# EAGLE board Speaker_shield (EAGLE 5.11)
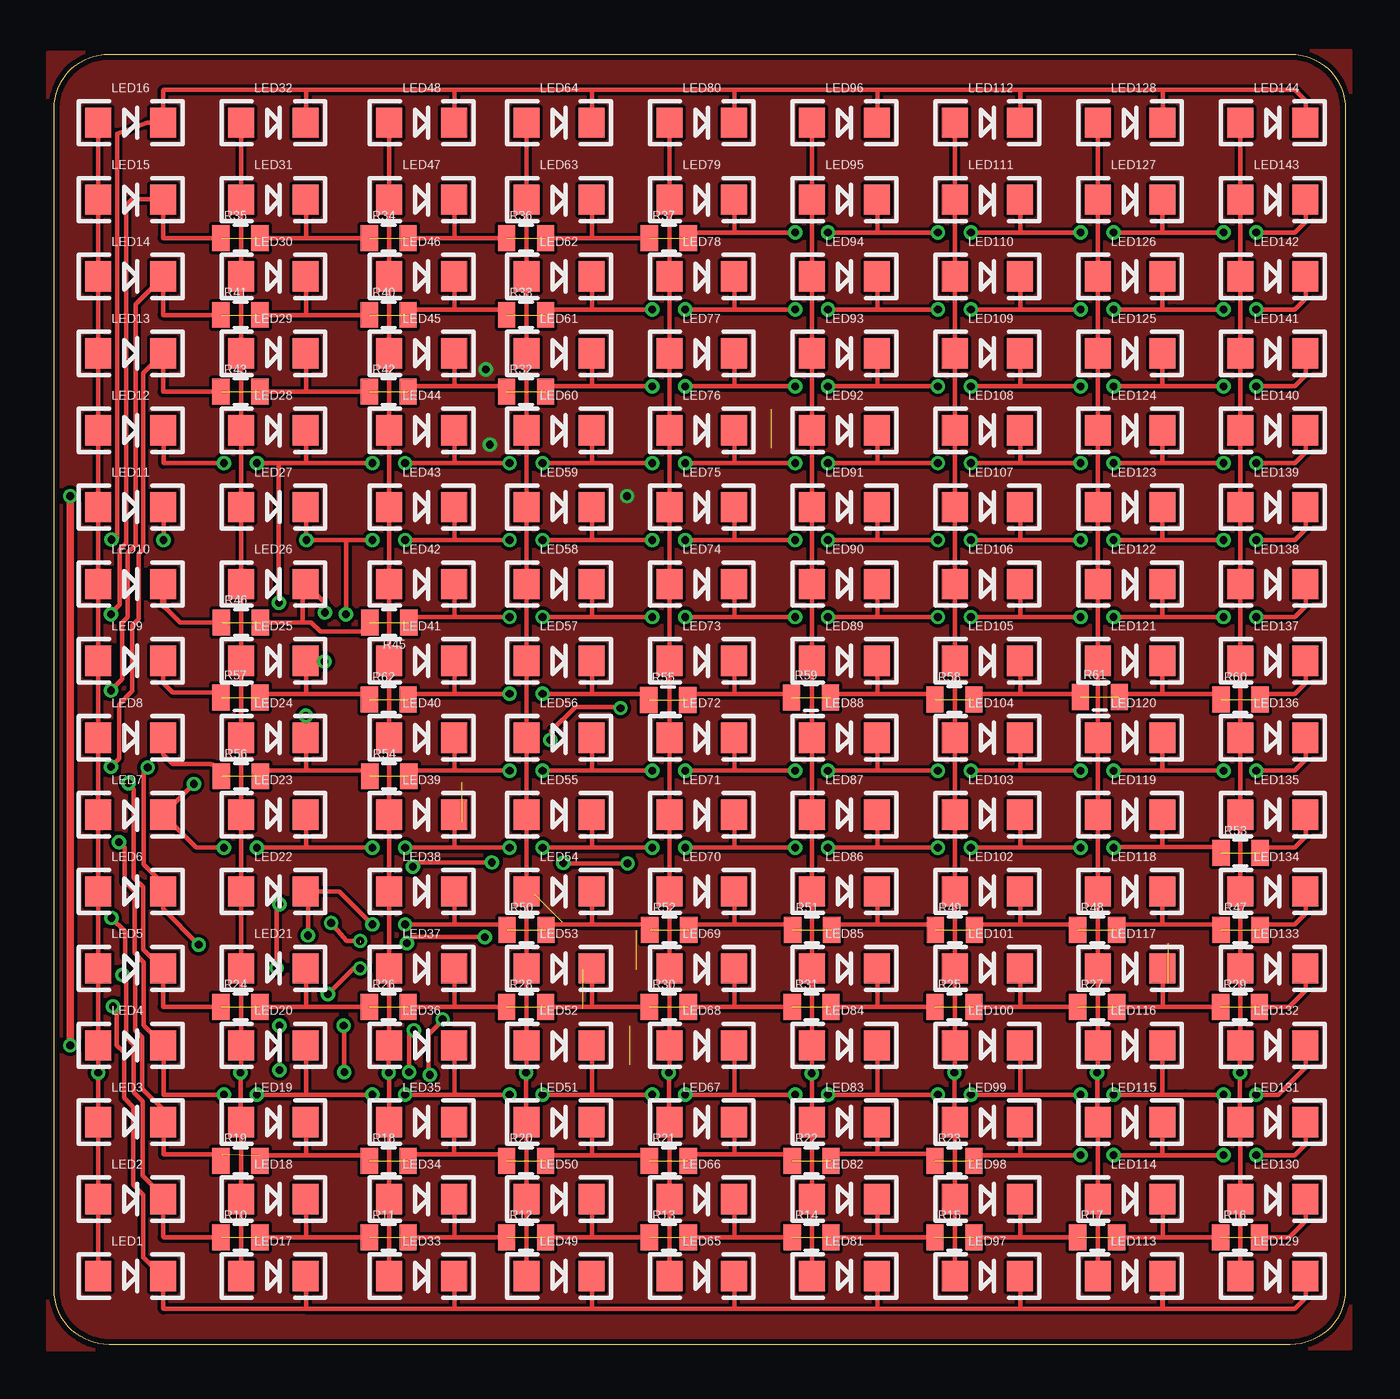
[diagram p3: board, top side]
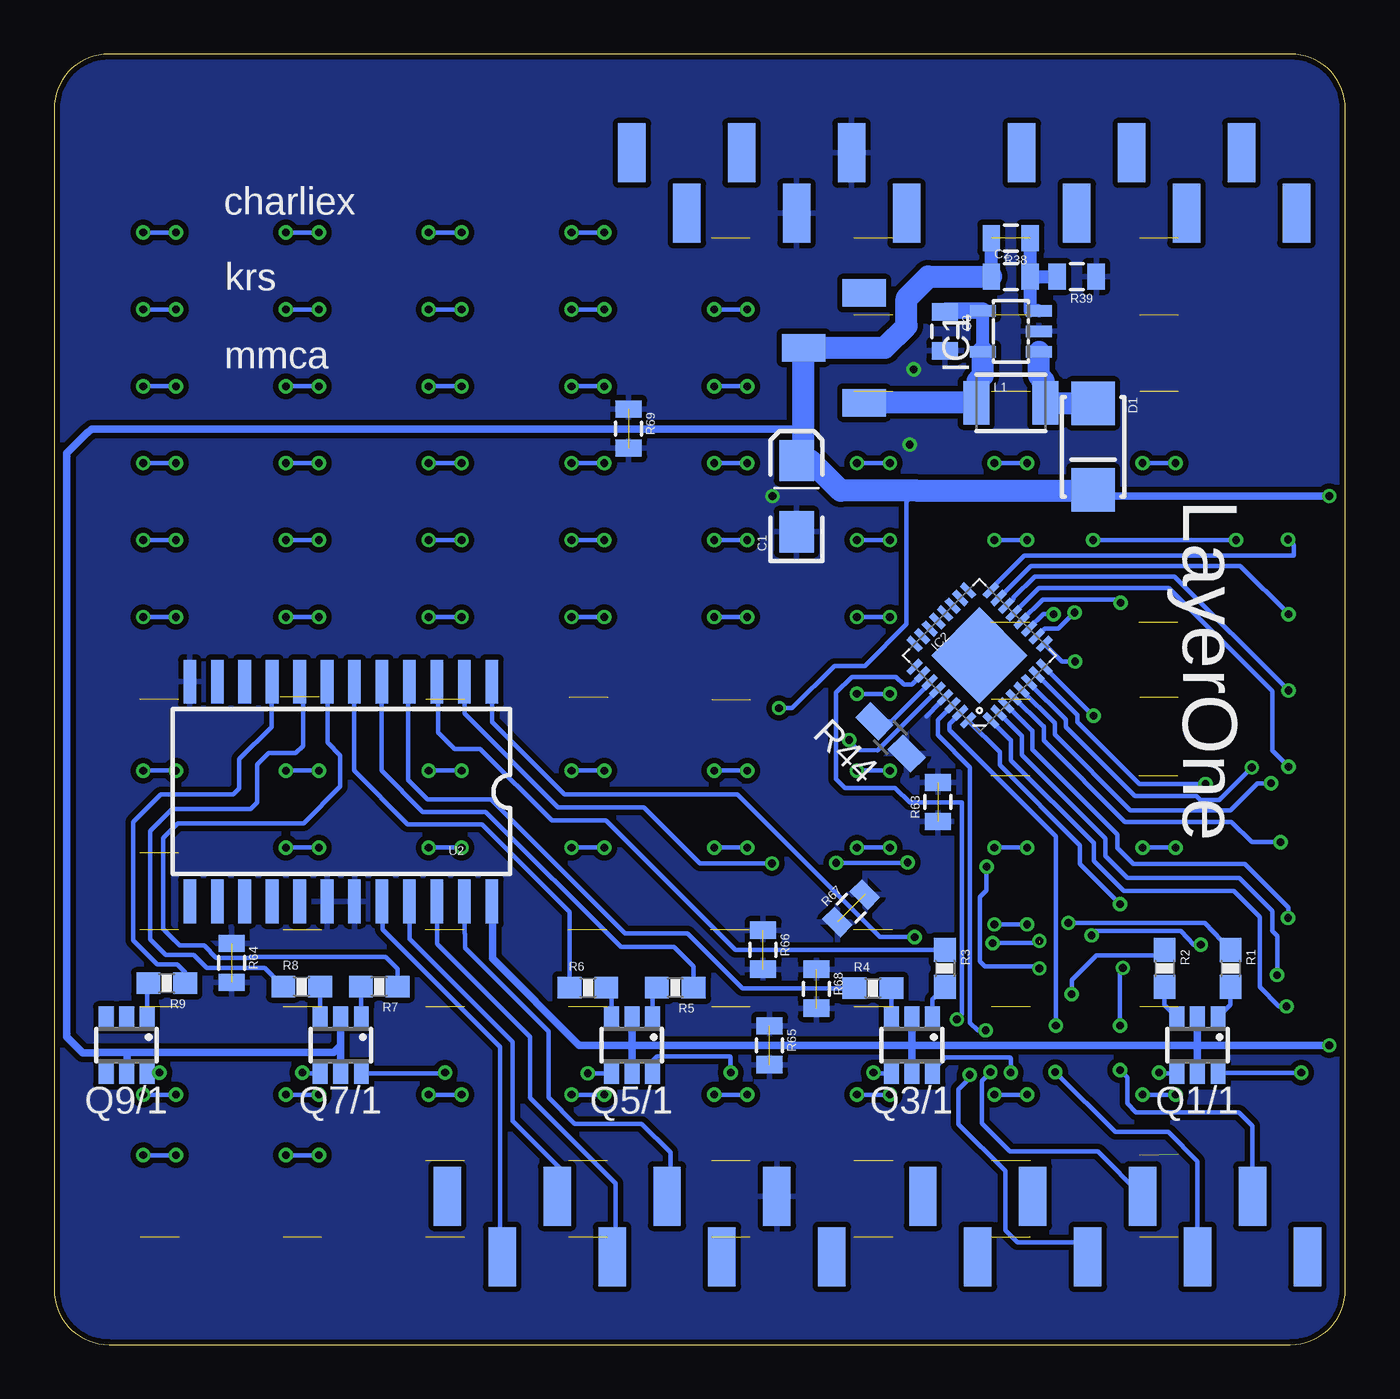
[diagram p4: board, bottom side, seen from below]

Size 59.73 x 59.69 mm. Coordinates in mm from the lower left corner, seen from the top.
Outline: 0,57.15 arc-90 2.54,59.69 57.19,59.69 arc-90 59.73,57.15 59.73,2.54 arc-90 57.19,0 2.54,0 arc-90 0,2.54 0,57.15
Copper layers (1*16): Top 0.035mm / dielectric 1.5mm / Bottom 0.035mm
Design rules "ITead_rule": minimum track width 6mil, minimum drill 12mil, track to track 6mil, track to pad 6mil, pad to pad 6mil, via to via 6mil, smd to smd 0mil, copper to edge 10mil, drill to drill 10mil, minimum pad ring 10mil, minimum via ring 6mil, stop-mask expansion 2mil, vias tented up to drill 100mil, thermal gap 10mil
Net classes: 1 power: width 0.61 mm, drill 0.508 mm, clearance 0.152 mm; 2 gnd: width 0.305 mm, drill 0.508 mm, clearance 0.152 mm; 3 usbvcc: width 0.508 mm, drill 0.508 mm, clearance 0.152 mm; 4 aref: width 0.406 mm

## Footprints (pad centres in the part's own frame; a part is rotated, then mirrored left to right if it is on the bottom)
95293-401A06LF = smd 1.27 x 2.73: 1 -6.35,1.4; 2 -3.81,-1.4; 3 -1.27,1.4; 4 1.27,-1.4; 5 3.81,1.4; 6 6.35,-1.4
EIA3216-KIT = smd 1.9 x 1.6: A 1.65,0; C -1.65,0
0805 = smd 0.8 x 1.2: 1 -0.9,0; 2 0.9,0
SMA-DIODE_ALT = smd 2 x 2: A -2,0; C 2,0
SOT-23 = smd 0.55 x 1.2: 1 -0.95,-1.3; 2 0,-1.3; 3 0.95,-1.3; 4 0.95,1.3; 5 -0.95,1.3
QFN32_XLP = smd 0.285 x 0.8: 1 -1.75,-2.5; 2 -1.25,-2.5; 3 -0.75,-2.5; 4 -0.25,-2.5; 5 0.25,-2.5; 6 0.75,-2.5; 7 1.25,-2.5; 8 1.75,-2.5; 17 1.75,2.5; 18 1.25,2.5; 19 0.75,2.5; 20 0.25,2.5; 21 -0.25,2.5; 22 -0.75,2.5; 23 -1.25,2.5; 24 -1.75,2.5 | smd 0.8 x 0.285: 9 2.5,-1.75; 10 2.5,-1.25; 11 2.5,-0.75; 12 2.5,-0.25; 13 2.5,0.25; 14 2.5,0.75; 15 2.5,1.25; 16 2.5,1.75; 25 -2.5,1.75; 26 -2.5,1.25; 27 -2.5,0.75; 28 -2.5,0.25; 29 -2.5,-0.25; 30 -2.5,-0.75; 31 -2.5,-1.25; 32 -2.5,-1.75 | smd 3.15 x 3.15: EP 0,0
1X3SMD = smd 1.27 x 2: 1 0,1.4; 2 -2.54,-1.4; 3 -5.08,1.4
1X08SMD = smd 1.27 x 2.73: 1 -8.89,1.4; 2 -6.35,-1.4; 3 -3.81,1.4; 4 -1.27,-1.4; 5 1.27,1.4; 6 3.81,-1.4; 7 6.35,1.4; 8 8.89,-1.4
1210 = smd 1.2 x 2: 1 -1.6,0; 2 1.6,0
NSL_SPARKFUN_LED-1206 = smd 1.2 x 1.4: A -1.5,0; C 1.5,0
SSOT-6 = smd 0.69 x 0.99: 1 -0.95,-1.3; 2 0,-1.3; 3 0.95,-1.3; 4 0.95,1.3; 5 0,1.3; 6 -0.95,1.3
SPARKFUN_0603-RES = smd 1.1 x 1: 1 -0.85,0; 2 0.85,0
R0805W = smd 1.5 x 1: 1 -1.052,0; 2 1.052,0
SO-24DW = smd 0.584 x 2.032: 1 -6.35,-5.08; 2 -5.08,-5.08; 3 -3.81,-5.08; 4 -2.54,-5.08; 5 -1.27,-5.08; 6 0,-5.08; 7 1.27,-5.08; 8 2.54,-5.08; 9 3.81,-5.08; 10 5.08,-5.08; 11 6.35,-5.08; 12 7.62,-5.08; 13 7.62,5.08; 14 6.35,5.08; 15 5.08,5.08; 16 3.81,5.08; 17 2.54,5.08; 18 1.27,5.08; 19 0,5.08; 20 -1.27,5.08; 21 -2.54,5.08; 22 -3.81,5.08; 23 -5.08,5.08; 24 -6.35,5.08

## Placement (x,y rotation side)
6XSMD1  [95293-401A06LF]  26.66,53.72 0 bottom
6XSMD2  [95293-401A06LF]  8.62,53.72 0 bottom
C1  4.7uF  [EIA3216-KIT]  25.38,39.24 90 bottom
C2  3.3pf  [0805]  15.48,49.4 0 bottom
C3  4.7uF  [0805]  18.53,46.86 270 bottom
D1  [SMA-DIODE_ALT]  11.67,41.53 270 bottom
IC1  TPS61040  [SOT-23]  15.48,46.86 90 bottom
IC2  TLC5947XLP  [QFN32_XLP]  16.93,31.88 45 bottom
JP1  [1X3SMD]  23.66,43.56 270 bottom
JP2  [1X08SMD]  32.65,5.46 0 bottom
JP3  [1X08SMD]  10.65,5.46 0 bottom
L1  3.3uH BRL3225T100K  [1210]  15.48,43.56 0 bottom
LED1  [NSL_SPARKFUN_LED-1206]  3.54,3.18 0 top
LED2  [NSL_SPARKFUN_LED-1206]  3.54,6.73 0 top
LED3  [NSL_SPARKFUN_LED-1206]  3.54,10.29 0 top
LED4  [NSL_SPARKFUN_LED-1206]  3.54,13.84 0 top
LED5  [NSL_SPARKFUN_LED-1206]  3.54,17.4 0 top
LED6  [NSL_SPARKFUN_LED-1206]  3.54,20.95 0 top
LED7  [NSL_SPARKFUN_LED-1206]  3.54,24.51 0 top
LED8  [NSL_SPARKFUN_LED-1206]  3.54,28.07 0 top
LED9  [NSL_SPARKFUN_LED-1206]  3.54,31.62 0 top
LED10  [NSL_SPARKFUN_LED-1206]  3.54,35.18 0 top
LED11  [NSL_SPARKFUN_LED-1206]  3.54,38.73 0 top
LED12  [NSL_SPARKFUN_LED-1206]  3.54,42.29 0 top
LED13  [NSL_SPARKFUN_LED-1206]  3.54,45.85 0 top
LED14  [NSL_SPARKFUN_LED-1206]  3.54,49.4 0 top
LED15  [NSL_SPARKFUN_LED-1206]  3.54,52.96 0 top
LED16  [NSL_SPARKFUN_LED-1206]  3.54,56.52 0 top
LED17  [NSL_SPARKFUN_LED-1206]  10.14,3.18 0 top
LED18  [NSL_SPARKFUN_LED-1206]  10.14,6.73 0 top
LED19  [NSL_SPARKFUN_LED-1206]  10.14,10.29 0 top
LED20  [NSL_SPARKFUN_LED-1206]  10.14,13.84 0 top
LED21  [NSL_SPARKFUN_LED-1206]  10.14,17.4 0 top
LED22  [NSL_SPARKFUN_LED-1206]  10.14,20.95 0 top
LED23  [NSL_SPARKFUN_LED-1206]  10.14,24.51 0 top
LED24  [NSL_SPARKFUN_LED-1206]  10.14,28.07 0 top
LED25  [NSL_SPARKFUN_LED-1206]  10.14,31.62 0 top
LED26  [NSL_SPARKFUN_LED-1206]  10.14,35.18 0 top
LED27  [NSL_SPARKFUN_LED-1206]  10.14,38.73 0 top
LED28  [NSL_SPARKFUN_LED-1206]  10.14,42.29 0 top
LED29  [NSL_SPARKFUN_LED-1206]  10.14,45.85 0 top
LED30  [NSL_SPARKFUN_LED-1206]  10.14,49.4 0 top
LED31  [NSL_SPARKFUN_LED-1206]  10.14,52.96 0 top
LED32  [NSL_SPARKFUN_LED-1206]  10.14,56.52 0 top
LED33  [NSL_SPARKFUN_LED-1206]  17,3.18 0 top
LED34  [NSL_SPARKFUN_LED-1206]  17,6.73 0 top
LED35  [NSL_SPARKFUN_LED-1206]  17,10.29 0 top
LED36  [NSL_SPARKFUN_LED-1206]  17,13.84 0 top
LED37  [NSL_SPARKFUN_LED-1206]  17,17.4 0 top
LED38  [NSL_SPARKFUN_LED-1206]  17,20.95 0 top
LED39  [NSL_SPARKFUN_LED-1206]  17,24.51 0 top
LED40  [NSL_SPARKFUN_LED-1206]  17,28.07 0 top
LED41  [NSL_SPARKFUN_LED-1206]  17,31.62 0 top
LED42  [NSL_SPARKFUN_LED-1206]  17,35.18 0 top
LED43  [NSL_SPARKFUN_LED-1206]  17,38.73 0 top
LED44  [NSL_SPARKFUN_LED-1206]  17,42.29 0 top
LED45  [NSL_SPARKFUN_LED-1206]  17,45.85 0 top
LED46  [NSL_SPARKFUN_LED-1206]  17,49.4 0 top
LED47  [NSL_SPARKFUN_LED-1206]  17,52.96 0 top
LED48  [NSL_SPARKFUN_LED-1206]  17,56.52 0 top
LED49  [NSL_SPARKFUN_LED-1206]  23.35,3.18 0 top
LED50  [NSL_SPARKFUN_LED-1206]  23.35,6.73 0 top
LED51  [NSL_SPARKFUN_LED-1206]  23.35,10.29 0 top
LED52  [NSL_SPARKFUN_LED-1206]  23.35,13.84 0 top
LED53  [NSL_SPARKFUN_LED-1206]  23.35,17.4 0 top
LED54  [NSL_SPARKFUN_LED-1206]  23.35,20.95 0 top
LED55  [NSL_SPARKFUN_LED-1206]  23.35,24.51 0 top
LED56  [NSL_SPARKFUN_LED-1206]  23.35,28.07 0 top
LED57  [NSL_SPARKFUN_LED-1206]  23.35,31.62 0 top
LED58  [NSL_SPARKFUN_LED-1206]  23.35,35.18 0 top
LED59  [NSL_SPARKFUN_LED-1206]  23.35,38.73 0 top
LED60  [NSL_SPARKFUN_LED-1206]  23.35,42.29 0 top
LED61  [NSL_SPARKFUN_LED-1206]  23.35,45.85 0 top
LED62  [NSL_SPARKFUN_LED-1206]  23.35,49.4 0 top
LED63  [NSL_SPARKFUN_LED-1206]  23.35,52.96 0 top
LED64  [NSL_SPARKFUN_LED-1206]  23.35,56.52 0 top
LED65  [NSL_SPARKFUN_LED-1206]  29.96,3.18 0 top
LED66  [NSL_SPARKFUN_LED-1206]  29.96,6.73 0 top
LED67  [NSL_SPARKFUN_LED-1206]  29.96,10.29 0 top
LED68  [NSL_SPARKFUN_LED-1206]  29.96,13.84 0 top
LED69  [NSL_SPARKFUN_LED-1206]  29.96,17.4 0 top
LED70  [NSL_SPARKFUN_LED-1206]  29.96,20.95 0 top
LED71  [NSL_SPARKFUN_LED-1206]  29.96,24.51 0 top
LED72  [NSL_SPARKFUN_LED-1206]  29.96,28.07 0 top
LED73  [NSL_SPARKFUN_LED-1206]  29.96,31.62 0 top
LED74  [NSL_SPARKFUN_LED-1206]  29.96,35.18 0 top
LED75  [NSL_SPARKFUN_LED-1206]  29.96,38.73 0 top
LED76  [NSL_SPARKFUN_LED-1206]  29.96,42.29 0 top
LED77  [NSL_SPARKFUN_LED-1206]  29.96,45.85 0 top
LED78  [NSL_SPARKFUN_LED-1206]  29.96,49.4 0 top
LED79  [NSL_SPARKFUN_LED-1206]  29.96,52.96 0 top
LED80  [NSL_SPARKFUN_LED-1206]  29.96,56.52 0 top
LED81  [NSL_SPARKFUN_LED-1206]  36.56,3.18 0 top
LED82  [NSL_SPARKFUN_LED-1206]  36.56,6.73 0 top
LED83  [NSL_SPARKFUN_LED-1206]  36.56,10.29 0 top
LED84  [NSL_SPARKFUN_LED-1206]  36.56,13.84 0 top
LED85  [NSL_SPARKFUN_LED-1206]  36.56,17.4 0 top
LED86  [NSL_SPARKFUN_LED-1206]  36.56,20.95 0 top
LED87  [NSL_SPARKFUN_LED-1206]  36.56,24.51 0 top
LED88  [NSL_SPARKFUN_LED-1206]  36.56,28.07 0 top
LED89  [NSL_SPARKFUN_LED-1206]  36.56,31.62 0 top
LED90  [NSL_SPARKFUN_LED-1206]  36.56,35.18 0 top
LED91  [NSL_SPARKFUN_LED-1206]  36.56,38.73 0 top
LED92  [NSL_SPARKFUN_LED-1206]  36.56,42.29 0 top
LED93  [NSL_SPARKFUN_LED-1206]  36.56,45.85 0 top
LED94  [NSL_SPARKFUN_LED-1206]  36.56,49.4 0 top
LED95  [NSL_SPARKFUN_LED-1206]  36.56,52.96 0 top
LED96  [NSL_SPARKFUN_LED-1206]  36.56,56.52 0 top
LED97  [NSL_SPARKFUN_LED-1206]  43.16,3.18 0 top
LED98  [NSL_SPARKFUN_LED-1206]  43.16,6.73 0 top
LED99  [NSL_SPARKFUN_LED-1206]  43.16,10.29 0 top
LED100  [NSL_SPARKFUN_LED-1206]  43.16,13.84 0 top
LED101  [NSL_SPARKFUN_LED-1206]  43.16,17.4 0 top
LED102  [NSL_SPARKFUN_LED-1206]  43.16,20.95 0 top
LED103  [NSL_SPARKFUN_LED-1206]  43.16,24.51 0 top
LED104  [NSL_SPARKFUN_LED-1206]  43.16,28.07 0 top
LED105  [NSL_SPARKFUN_LED-1206]  43.16,31.62 0 top
LED106  [NSL_SPARKFUN_LED-1206]  43.16,35.18 0 top
LED107  [NSL_SPARKFUN_LED-1206]  43.16,38.73 0 top
LED108  [NSL_SPARKFUN_LED-1206]  43.16,42.29 0 top
LED109  [NSL_SPARKFUN_LED-1206]  43.16,45.85 0 top
LED110  [NSL_SPARKFUN_LED-1206]  43.16,49.4 0 top
LED111  [NSL_SPARKFUN_LED-1206]  43.16,52.96 0 top
LED112  [NSL_SPARKFUN_LED-1206]  43.16,56.52 0 top
LED113  [NSL_SPARKFUN_LED-1206]  49.77,3.18 0 top
LED114  [NSL_SPARKFUN_LED-1206]  49.77,6.73 0 top
LED115  [NSL_SPARKFUN_LED-1206]  49.77,10.29 0 top
LED116  [NSL_SPARKFUN_LED-1206]  49.77,13.84 0 top
LED117  [NSL_SPARKFUN_LED-1206]  49.77,17.4 0 top
LED118  [NSL_SPARKFUN_LED-1206]  49.77,20.95 0 top
LED119  [NSL_SPARKFUN_LED-1206]  49.77,24.51 0 top
LED120  [NSL_SPARKFUN_LED-1206]  49.77,28.07 0 top
LED121  [NSL_SPARKFUN_LED-1206]  49.77,31.62 0 top
LED122  [NSL_SPARKFUN_LED-1206]  49.77,35.18 0 top
LED123  [NSL_SPARKFUN_LED-1206]  49.77,38.73 0 top
LED124  [NSL_SPARKFUN_LED-1206]  49.77,42.29 0 top
LED125  [NSL_SPARKFUN_LED-1206]  49.77,45.85 0 top
LED126  [NSL_SPARKFUN_LED-1206]  49.77,49.4 0 top
LED127  [NSL_SPARKFUN_LED-1206]  49.77,52.96 0 top
LED128  [NSL_SPARKFUN_LED-1206]  49.77,56.52 0 top
LED129  [NSL_SPARKFUN_LED-1206]  56.37,3.18 0 top
LED130  [NSL_SPARKFUN_LED-1206]  56.37,6.73 0 top
LED131  [NSL_SPARKFUN_LED-1206]  56.37,10.29 0 top
LED132  [NSL_SPARKFUN_LED-1206]  56.37,13.84 0 top
LED133  [NSL_SPARKFUN_LED-1206]  56.37,17.4 0 top
LED134  [NSL_SPARKFUN_LED-1206]  56.37,20.95 0 top
LED135  [NSL_SPARKFUN_LED-1206]  56.37,24.51 0 top
LED136  [NSL_SPARKFUN_LED-1206]  56.37,28.07 0 top
LED137  [NSL_SPARKFUN_LED-1206]  56.37,31.62 0 top
LED138  [NSL_SPARKFUN_LED-1206]  56.37,35.18 0 top
LED139  [NSL_SPARKFUN_LED-1206]  56.37,38.73 0 top
LED140  [NSL_SPARKFUN_LED-1206]  56.37,42.29 0 top
LED141  [NSL_SPARKFUN_LED-1206]  56.37,45.85 0 top
LED142  [NSL_SPARKFUN_LED-1206]  56.37,49.4 0 top
LED143  [NSL_SPARKFUN_LED-1206]  56.37,52.96 0 top
LED144  [NSL_SPARKFUN_LED-1206]  56.37,56.52 0 top
Q1/1  FMB3906SUPERSOT-6  [SSOT-6]  6.84,13.84 180 bottom
Q3/1  FMB3906SUPERSOT-6  [SSOT-6]  20.05,13.84 180 bottom
Q5/1  FMB3906SUPERSOT-6  [SSOT-6]  33.01,13.84 180 bottom
Q7/1  FMB3906SUPERSOT-6  [SSOT-6]  46.47,13.84 180 bottom
Q9/1  FMB3906SUPERSOT-6  [SSOT-6]  56.37,13.84 180 bottom
R1  [SPARKFUN_0603-RES]  5.32,17.4 270 bottom
R2  [SPARKFUN_0603-RES]  8.37,17.4 270 bottom
R3  [SPARKFUN_0603-RES]  18.53,17.4 270 bottom
R4  [SPARKFUN_0603-RES]  21.85,16.48 0 bottom
R5  [SPARKFUN_0603-RES]  31,16.51 180 bottom
R6  [SPARKFUN_0603-RES]  35.04,16.51 0 bottom
R7  [SPARKFUN_0603-RES]  44.69,16.56 180 bottom
R8  [SPARKFUN_0603-RES]  48.27,16.56 0 bottom
R9  [SPARKFUN_0603-RES]  54.52,16.71 180 bottom
R10  [0805]  8.62,4.95 0 top
R11  [0805]  15.48,4.95 0 top
R12  [0805]  21.83,4.95 0 top
R13  [0805]  28.43,4.95 0 top
R14  [0805]  35.04,4.95 0 top
R15  [0805]  41.64,4.95 0 top
R16  [0805]  54.85,4.95 0 top
R17  [0805]  48.24,4.95 0 top
R18  [0805]  15.48,8.51 0 top
R19  [0805]  8.62,8.51 0 top
R20  [0805]  21.83,8.51 0 top
R21  [0805]  28.43,8.51 0 top
R22  [0805]  35.04,8.51 0 top
R23  [0805]  41.64,8.51 0 top
R24  [0805]  8.62,15.62 0 top
R25  [0805]  41.64,15.62 0 top
R26  [0805]  15.48,15.62 0 top
R27  [0805]  48.24,15.62 0 top
R28  [0805]  21.83,15.62 0 top
R29  [0805]  54.85,15.62 0 top
R30  [0805]  28.43,15.62 0 top
R31  [0805]  35.04,15.62 0 top
R32  [0805]  21.83,44.07 0 top
R33  [0805]  21.83,47.62 0 top
R34  [0805]  15.48,51.18 0 top
R35  [0805]  8.62,51.18 0 top
R36  [0805]  21.83,51.18 0 top
R37  [0805]  28.43,51.18 0 top
R38  620k  [0805]  15.48,51.18 180 bottom
R39  200k  [0805]  12.43,49.4 180 bottom
R40  [0805]  15.48,47.62 0 top
R41  [0805]  8.62,47.62 0 top
R42  [0805]  15.48,44.07 0 top
R43  [0805]  8.62,44.07 0 top
R44  20K  [R0805W]  21.04,28.09 135 bottom
R45  [0805]  15.5,33.4 180 top
R46  [0805]  8.65,33.4 0 top
R47  [0805]  54.87,19.18 0 top
R48  [0805]  48.24,19.18 0 top
R49  [0805]  41.67,19.18 0 top
R50  [0805]  21.85,19.18 0 top
R51  [0805]  35.06,19.18 0 top
R52  [0805]  28.46,19.18 0 top
R53  [0805]  54.87,22.73 0 top
R54  [0805]  15.5,26.29 0 top
R55  [0805]  28.41,29.82 0 top
R56  [0805]  8.65,26.29 0 top
R57  [0805]  8.62,29.92 0 top
R58  [0805]  41.64,29.84 0 top
R59  [0805]  35.01,29.92 0 top
R60  [0805]  54.87,29.84 0 top
R61  [0805]  48.37,29.95 0 top
R62  [0805]  15.48,29.84 0 top
R63  0ohm  [0805]  18.86,25.1 90 bottom
R64  0ohm  [0805]  51.52,17.65 270 bottom
R65  0ohm  [0805]  26.63,13.84 270 bottom
R66  0ohm  [0805]  26.93,18.26 270 bottom
R67  0ohm  [0805]  22.86,20.18 45 bottom
R68  0ohm  [0805]  24.47,16.46 270 bottom
R69  0ohm  [0805]  33.16,42.37 270 bottom
U2  CD74HC154M  [SO-24DW]  45.83,25.58 180 bottom

## Tracks (layer width: path | path; a pad name or v marks a point on that pad's centre or on a via)
A3
  Bottom 0.203: U2.20 44.51,20.45 44.54,20.42 44.54,19.2 39.1,13.77 39.1,4.16 JP2.2
BLANK  (via drill 0.36)
  Top 0.203: v16.65,14.53 16.42,14.3 v16.42,12.6
  Bottom 0.203: IC2.30 18.86,28.89 18.86,28.19 17.36,26.7 17.36,14.88 17,14.53 v16.65,14.53 | JP3.5 11.46,8.94 15.53,8.94 16.82,10.24 16.82,12.19 v16.42,12.6
COL1  (via drill 0.36)
  Top 0.203: LED129.C 57.9,3.15 57.9,2.16 57.39,1.65 51.29,1.65 | 51.29,1.65 51.27,1.68 LED113.C 51.29,3.15 51.29,1.65 | 44.69,1.65 51.29,1.65 | 38.09,1.65 44.69,1.65 | 31.48,1.65 38.09,1.65 | 24.88,1.65 31.48,1.65 | 18.53,1.65 24.88,1.65 | 11.67,1.65 18.53,1.65 | 11.67,1.65 5.07,1.65 5.04,1.68 LED1.C 4.99,3.18 4.13,4.04 4.13,6.93 3.67,7.39 3.67,10.97 3.24,11.41 3.24,13.51 2.91,13.84 2.91,15.47 v2.73,15.65 | LED97.C 44.69,3.15 44.69,1.65 | LED81.C 38.09,3.15 38.09,1.65 | LED65.C 31.48,3.15 31.48,1.65 | LED49.C 24.88,3.15 24.88,1.65 | LED33.C 18.53,3.15 18.53,1.65 | LED17.C 11.67,3.15 11.67,1.65
  Bottom 0.203: IC2.1 15.49,27.97 15.48,27.97 15.48,27.03 11.64,23.19 11.64,22.38 10.25,20.98 5.17,20.98 3.97,19.79 3.97,16.54 3.08,15.65 v2.73,15.65
COL2  (via drill 0.36)  (8 unrouted)
  Top 0.203: LED130.C 57.9,6.71 57.9,5.71 57.13,4.95 R16.2 | 51.29,4.95 R16.1 | R17.2 51.29,4.95 | LED114.C 51.29,6.71 51.29,4.95 | 44.69,4.95 R17.1 | R15.2 44.69,4.95 | LED98.C 44.69,6.71 44.69,4.95 | 38.09,4.95 R15.1 | R14.2 38.09,4.95 | LED82.C 38.09,6.71 38.09,4.95 | 31.48,4.95 R14.1 | R13.2 31.48,4.95 | LED66.C 31.48,6.71 31.48,4.95 | 24.88,4.95 R13.1 | R12.2 24.88,4.95 | LED50.C 24.88,6.71 24.88,4.95 | 18.53,4.95 R12.1 | R11.2 18.53,4.95 | LED34.C 18.53,6.71 18.53,4.95 | 11.67,4.95 R11.1 | R10.2 11.67,4.95 | LED18.C 11.67,6.71 11.67,4.95 | R10.1 5.07,4.95 5.04,4.98 LED2.C 5.04,6.86 4.1,7.8 4.1,11.25 3.69,11.66 3.69,13.87 3.34,14.22 3.34,16.92 v3.16,17.09
  Bottom 0.203: IC2.2 15,28.18 15,28.17 14.97,28.14 14.97,27.28 11.11,23.42 11.11,22.61 10.09,21.59 4.91,21.59 3.39,20.07 3.39,19.13 3.16,18.9 v3.16,17.09
COL3  (via drill 0.36)  (6 unrouted)
  Top 0.203: LED131.C 57.9,10.26 57.9,9.27 57.39,8.76 v55.61,8.76 | 51.29,8.76 v54.09,8.76 | 51.29,8.76 51.27,8.79 LED115.C | LED99.C 44.69,10.26 44.69,8.76 | 44.69,8.76 v47.48,8.76 | v49.01,8.76 51.29,8.76 | 11.67,10.26 LED19.C 11.67,10.29 11.67,8.76 | 18.53,10.26 LED35.C 18.5,8.79 | 24.88,10.26 LED51.C 24.88,10.29 24.88,8.76 | 31.48,10.26 LED67.C 31.48,10.29 31.48,8.79 | 38.09,10.26 LED83.C 38.09,10.29 38.09,8.81 | v2.65,19.74 3.29,19.1 3.29,17.96 3.74,17.5 3.74,14.53 4.07,14.2 4.07,11.84 5.07,10.85 5.07,10.31 LED3.C 5.07,10.29 5.07,8.79 7.72,8.79 R19.1 | R23.2 42.8,8.76 44.69,8.76 | R22.2 36.24,8.81 38.09,8.81 | R23.1 40.74,8.81 38.09,8.81 | R22.1 34.14,8.79 31.48,8.79 | R21.2 29.33,8.79 31.48,8.79 | R21.1 27.53,8.76 24.88,8.76 | R20.2 22.73,8.76 24.88,8.76 | R20.1 20.93,8.79 18.5,8.79 | R18.2 16.38,8.79 18.5,8.79 | R18.1 14.58,8.76 11.67,8.76 | R19.2 9.52,8.76 11.67,8.76
  Bottom 0.203: v54.09,8.76 v55.61,8.76 | v47.48,8.76 v49.01,8.76 | IC2.3 14.51,28.4 14.49,28.4 14.49,27.53 10.55,23.6 10.55,22.96 9.82,22.23 4.66,22.23 2.65,20.22 v2.65,19.74
COL4  (via drill 0.36)
  Top 0.203: LED132.C 57.9,13.82 57.9,12.83 56.63,11.56 v55.61,11.56 | 51.29,11.56 52.31,11.56 v54.09,11.56 | 51.29,11.56 51.27,11.58 LED116.C | LED100.C 44.69,13.82 44.69,11.56 | v47.48,11.56 45.2,11.56 44.69,11.56 | v49.01,11.56 51.29,11.56 | LED84.C 38.09,13.82 38.09,11.56 | 38.09,11.56 v40.88,11.56 | v42.4,11.56 44.69,11.56 | LED68.C 31.48,13.82 31.48,11.56 | v34.27,11.56 31.99,11.56 31.48,11.56 | v35.8,11.56 38.09,11.56 | LED52.C 24.88,13.82 24.88,11.56 | 24.88,11.56 v27.67,11.56 | v29.2,11.56 31.48,11.56 | LED36.C 18.53,13.82 18.53,11.56 | 18.53,11.56 v21.07,11.56 | v22.59,11.56 24.88,11.56 | LED20.C 11.67,13.82 11.67,11.56 | 11.67,11.56 v14.72,11.56 | v16.24,11.56 18.53,11.56 | v7.86,11.56 5.07,11.56 5.07,13.82 LED4.C 5.04,13.87 4.15,14.76 4.15,17.68 3.72,18.11 3.72,20.95 3.26,21.41 3.26,22.99 v3.01,23.24 | v9.38,11.56 11.67,11.56
  Bottom 0.203: v54.09,11.56 v55.61,11.56 | v47.48,11.56 v49.01,11.56 | v40.88,11.56 v42.4,11.56 | v34.27,11.56 v35.8,11.56 | v27.67,11.56 v29.2,11.56 | v21.07,11.56 v22.59,11.56 | v14.72,11.56 v16.24,11.56 | v7.86,11.56 v9.38,11.56 | IC2.4 14.01,28.6 13.98,28.6 13.96,28.58 13.96,27.94 10.2,24.18 5.27,24.18 4.33,23.24 v3.01,23.24
COL5  (via drill 0.36)  (8 unrouted)
  Top 0.203: LED133.C 57.9,17.38 57.9,16.38 57.13,15.62 R29.2 | R27.2 51.29,15.62 | 51.29,15.62 R29.1 | 44.69,15.62 R27.1 | R25.2 44.69,15.62 | 38.09,15.62 R25.1 | R31.2 38.09,15.62 | 31.48,15.62 R31.1 | R30.2 31.48,15.62 | 24.88,15.62 R30.1 | R28.2 24.88,15.62 | 18.53,15.62 R28.1 | R26.2 18.53,15.62 | 11.67,15.62 R26.1 | R24.2 11.67,15.62 | R24.1 5.04,15.62 LED5.C 5.01,17.4 4.13,18.29 4.13,21.16 3.69,21.59 3.69,25.7 v3.44,25.96 | LED21.C 11.67,17.4 11.67,15.62 | LED37.C 18.53,17.4 18.53,15.62 | LED53.C 24.88,17.4 24.88,15.62 | LED69.C 31.48,17.4 31.48,15.62 | LED117.C 51.29,17.4 51.29,15.62 | LED101.C 44.69,17.4 44.69,15.62 | LED85.C 38.09,17.4 38.09,15.62
  Bottom 0.203: IC2.5 13.45,28.75 13.45,28.22 9.94,24.71 5.32,24.71 4.07,25.96 v3.44,25.96
COL6  (via drill 0.36)  (6 unrouted)
  Top 0.203: LED134.C 57.9,20.93 57.9,19.94 57.39,19.43 56.03,19.43 arc90 R47.2 | LED118.C 51.27,19.45 arc90 51.29,19.43 | LED102.C 44.69,20.93 44.69,19.43 | LED86.C 38.09,20.93 38.09,19.43 | LED70.C 31.48,20.93 31.48,19.43 | LED54.C 24.88,20.93 24.88,19.43 | LED38.C 18.53,20.93 18.53,19.43 | LED22.C 11.67,20.93 | v16.24,19.43 18.53,19.43 | LED6.C 5.07,20.93 | v4.33,26.7 4.15,26.52 4.15,22.2 5.04,21.31 LED6.C | v14.72,19.43 13.19,20.95 LED22.C | LED22.C 11.75,20.86 v11.75,18.92 | v6.69,18.49 5.04,20.14 LED6.C | R48.2 arc-90 49.4,19.43 51.29,19.43 | R49.2 arc-90 42.82,19.43 44.69,19.43 | R51.2 arc-90 36.22,19.43 38.09,19.43 | R48.1 arc90 47.09,19.43 44.69,19.43 | R49.1 arc90 40.51,19.43 38.09,19.43 | R51.1 arc90 33.91,19.43 31.48,19.43 | R52.2 arc-90 29.61,19.43 31.48,19.43 | R52.1 arc90 27.3,19.43 24.88,19.43 | R50.2 arc-90 23.01,19.43 24.88,19.43 | R50.1 arc90 20.7,19.43 18.53,19.43 | R47.1 53.72,19.43 51.29,19.43
  Bottom 0.203: v14.72,19.43 v16.24,19.43 | IC2.6 14.63,30.6 12.94,28.91 12.94,28.58 9.74,25.38 6.89,25.38 6.72,25.2 5.83,25.2 v4.33,26.7 | v11.75,18.92 11.64,19.13 7.61,19.13 7.02,18.49 v6.69,18.49
COL7  (via drill 0.36)  (1 unrouted)
  Top 0.203: LED135.C 57.9,24.49 57.9,23.49 57.39,22.99 56.03,22.99 R53.2 | 51.27,23.01 LED119.C | LED103.C 44.69,24.49 44.69,22.99 | 44.69,22.99 v47.48,22.99 | v49.01,22.99 49.03,23.01 51.27,23.01 | LED87.C 38.09,24.49 38.09,22.99 | 38.09,22.99 v40.88,22.99 | v42.4,22.99 44.69,22.99 | LED71.C 31.48,24.49 31.48,22.99 | 31.48,22.99 v34.27,22.99 | v35.8,22.99 38.09,22.99 | LED55.C 24.88,24.49 24.88,22.99 | 24.88,22.99 v27.67,22.99 | v29.2,22.99 31.48,22.99 | LED39.C 18.53,24.49 18.53,22.99 | 18.53,22.99 v21.07,22.99 | v22.59,22.99 24.88,22.99 | LED23.C 11.67,24.49 11.67,22.99 | 11.67,22.99 v14.72,22.99 | v16.24,22.99 18.53,22.99 | LED7.C 5.07,24.49 | v9.38,22.99 11.67,22.99 | LED7.C v6.46,25.93 | v7.86,22.99 6.57,22.99 LED7.C | R53.1 53.7,23.01 51.27,23.01
  Bottom 0.203: v47.48,22.99 v49.01,22.99 | v40.88,22.99 v42.4,22.99 | v34.27,22.99 v35.8,22.99 | v27.67,22.99 v29.2,22.99 | v21.07,22.99 v22.59,22.99 | v14.72,22.99 v16.24,22.99 | v7.86,22.99 v9.38,22.99 | IC2.7 12.41,29.12 12.41,28.8 9.54,25.93 v6.46,25.93
COL8  (via drill 0.36)  (2 unrouted)
  Top 0.203: LED136.C 57.9,28.04 57.9,27.05 57.39,26.54 v55.61,26.54 | 51.29,26.54 v54.09,26.54 | 51.29,26.54 51.27,26.57 LED120.C | LED104.C 44.69,28.04 44.69,26.54 | 44.69,26.54 v47.48,26.54 | v49.01,26.54 51.29,26.54 | LED88.C 38.09,28.04 38.09,26.54 | 38.09,26.54 v40.88,26.54 | v42.4,26.54 44.69,26.54 | LED72.C 31.48,28.04 31.48,26.54 | 31.48,26.54 v34.27,26.54 | v35.8,26.54 38.09,26.54 | LED56.C 24.88,28.04 24.88,26.54 | 24.88,26.54 v27.67,26.54 | v29.2,26.54 31.48,26.54 | LED40.C 18.53,28.04 18.53,26.54 | 18.53,26.54 v21.07,26.54 | v22.59,26.54 24.88,26.54 | 11.67,26.54 11.67,28.04 LED24.C v11.64,29.08 | 5.07,28.04 LED8.C 5.04,27.3 5.5,26.85 7.19,26.85 arc-90 R56.1 | R54.1 14.35,26.54 11.67,26.54 | R54.2 16.66,26.54 18.53,26.54 | R56.2 arc-90 9.8,26.54 11.67,26.54
  Bottom 0.203: v54.09,26.54 v55.61,26.54 | v47.48,26.54 v49.01,26.54 | v40.88,26.54 v42.4,26.54 | v27.67,26.54 v29.2,26.54 | v21.07,26.54 v22.59,26.54 | IC2.8 11.66,29.08 v11.64,29.08 | v34.27,26.54 v35.8,26.54
COL9  (via drill 0.36)  (7 unrouted)
  Top 0.203: LED137.C 57.9,31.6 57.9,30.61 57.39,30.1 56.03,30.1 R60.2 | 51.29,30.1 51.27,30.12 LED121.C | LED105.C 44.69,31.6 44.69,30.1 | LED89.C 38.09,31.6 38.09,30.1 | LED73.C 31.48,31.6 31.48,30.1 | LED57.C 24.88,31.6 24.88,30.1 | LED41.C 18.53,31.6 18.53,30.1 | 18.53,30.1 v21.07,30.1 | v22.59,30.1 24.88,30.1 | 11.67,30.1 11.67,31.6 LED25.C 12.48,31.62 v12.51,31.6 | 5.07,31.6 LED9.C 5.04,30.61 5.5,30.15 7.49,30.15 R57.1 | R60.1 53.72,30.1 51.29,30.1 | R61.2 49.42,30.1 51.29,30.1 | R61.1 47.32,30.1 44.69,30.1 | R58.2 42.8,30.1 44.69,30.1 | R58.1 40.49,30.1 38.09,30.1 | R59.2 36.09,30.1 38.09,30.1 | R59.1 33.93,30.1 31.48,30.1 | R55.2 29.59,30.1 31.48,30.1 | R55.1 27.23,30.1 24.88,30.1 | R62.2 16.63,30.1 18.53,30.1 | R62.1 14.33,30.1 11.67,30.1 | R57.2 9.7,30.1 11.67,30.1
  Bottom 0.203: v21.07,30.1 v22.59,30.1 | IC2.9 13.11,31.6 v12.51,31.6
COL10  (via drill 0.36)  (2 unrouted)
  Top 0.203: LED138.C 57.9,35.16 57.9,34.16 57.39,33.66 v55.61,33.66 | 51.29,33.66 v54.09,33.66 | 51.29,33.66 51.27,33.68 LED122.C | LED106.C 44.69,35.16 44.69,33.66 | 44.69,33.66 v47.48,33.66 | v49.01,33.66 51.29,33.66 | LED90.C 38.09,35.16 38.09,33.66 | 38.09,33.66 v40.88,33.66 | v42.4,33.66 44.69,33.66 | LED74.C 31.48,35.16 31.48,33.66 | 31.48,33.66 v34.27,33.66 | v35.8,33.66 38.09,33.66 | LED58.C 24.88,35.16 24.88,33.66 | 24.88,33.66 v27.67,33.66 | v29.2,33.66 31.48,33.66 | LED42.C 18.53,35.16 18.53,33.66 | 18.53,33.66 v21.07,33.66 | v22.59,33.66 24.88,33.66 | LED26.C 11.67,35.16 | LED26.C 11.62,35.15 | LED26.C | v12.53,33.86 12.53,34.29 LED26.C | 18.53,33.66 16.66,33.66 R45.1 | 11.49,33.4 11.9,33.4 12.33,32.97 14.6,32.97 R45.2 | 5.07,34.16 5.83,33.4 R46.1 | 11.49,33.4 R46.2 | 11.49,33.4 11.49,35.18 LED26.C
  Top 0.305: 5.07,34.16 5.04,34.19 LED10.C
  Bottom 0.203: v54.09,33.66 v55.61,33.66 | v47.48,33.66 v49.01,33.66 | v40.88,33.66 v42.4,33.66 | v34.27,33.66 v35.8,33.66 | v27.67,33.66 v29.2,33.66 | v21.07,33.66 v22.59,33.66 | IC2.10 13.9,33.12 13.27,33.12 v12.53,33.86
COL11  (via drill 0.36)
  Top 0.203: LED139.C 57.9,38.71 57.9,37.72 57.39,37.21 v55.61,37.21 | 51.29,37.21 51.8,37.21 v54.09,37.21 | 51.29,37.21 51.27,37.23 LED123.C | LED107.C 44.69,38.71 44.69,37.21 | 44.69,37.21 45.2,37.21 v47.48,37.21 | v49.01,37.21 51.29,37.21 | LED91.C 38.09,38.71 38.09,37.21 | 38.09,37.21 v40.88,37.21 | v42.4,37.21 44.69,37.21 | LED75.C 31.48,38.71 31.48,37.21 | 31.48,37.21 v34.27,37.21 | v35.8,37.21 38.09,37.21 | LED59.C 24.88,38.71 24.88,37.21 | 24.88,37.21 v27.67,37.21 | v29.2,37.21 31.48,37.21 | LED43.C 18.53,38.71 18.53,37.21 | 18.53,37.21 v21.07,37.21 | v22.59,37.21 24.88,37.21 | LED27.C 11.67,38.71 v11.67,37.21 13.5,37.21 | 13.5,37.21 v14.72,37.21 | v16.24,37.21 18.53,37.21 | v5.07,37.21 5.07,38.71 LED11.C | 13.5,37.21 v13.5,33.78
  Bottom 0.203: v54.09,37.21 v55.61,37.21 | v47.48,37.21 v49.01,37.21 | v40.88,37.21 v42.4,37.21 | v34.27,37.21 v35.8,37.21 | v27.67,37.21 v29.2,37.21 | v21.07,37.21 v22.59,37.21 | v14.72,37.21 v16.24,37.21 | v5.07,37.21 v11.67,37.21 | IC2.11 14.63,33.13 13.98,33.78 v13.5,33.78
COL12  (via drill 0.36)
  Top 0.203: LED140.C 57.9,42.27 57.9,41.27 57.39,40.77 v55.61,40.77 | 51.29,40.77 51.8,40.77 v54.09,40.77 | 51.29,40.77 51.27,40.79 LED124.C | LED108.C 44.69,42.27 44.69,40.77 | 44.69,40.77 v47.48,40.77 | v49.01,40.77 51.29,40.77 | LED92.C 38.09,42.27 38.09,40.77 | 38.09,40.77 v40.88,40.77 | v42.4,40.77 44.69,40.77 | LED76.C 31.48,42.27 31.48,40.77 | 31.48,40.77 v34.27,40.77 | v35.8,40.77 38.09,40.77 | LED60.C 24.88,42.27 24.88,40.77 | 24.88,40.77 v27.67,40.77 | v29.2,40.77 31.48,40.77 | LED44.C 18.53,42.27 18.53,40.77 | 18.53,40.77 v21.07,40.77 | v22.59,40.77 24.88,40.77 | LED28.C 11.67,42.27 11.67,40.77 | 11.67,40.77 v14.72,40.77 | v16.24,40.77 18.53,40.77 | LED12.C 5.07,42.27 5.07,40.77 v7.86,40.77 | 10.4,40.77 11.67,40.77 | 10.4,40.77 v9.38,40.77 | v10.4,34.31 10.4,40.77
  Bottom 0.203: v54.09,40.77 v55.61,40.77 | v47.48,40.77 v49.01,40.77 | v40.88,40.77 v42.4,40.77 | v34.27,40.77 v35.8,40.77 | v27.67,40.77 v29.2,40.77 | v21.07,40.77 v22.59,40.77 | v14.72,40.77 v16.24,40.77 | v9.38,40.77 v7.86,40.77 | IC2.12 14.98,33.49 14.01,34.47 10.58,34.47 v10.4,34.31
COL13  (via drill 0.36)  (3 unrouted)
  Top 0.203: LED141.C 57.9,45.82 57.9,44.83 57.39,44.32 v55.61,44.32 | 51.29,44.32 51.8,44.32 v54.09,44.32 | 51.29,44.32 51.27,44.35 LED125.C | LED109.C 44.69,45.82 44.69,44.32 | 44.69,44.32 v47.48,44.32 | v49.01,44.32 51.29,44.32 | LED93.C 38.09,45.82 38.09,44.32 | 38.09,44.32 v40.88,44.32 | v42.4,44.32 44.69,44.32 | LED77.C 31.48,45.82 31.48,44.32 | 31.48,44.32 v34.27,44.32 | v35.8,44.32 38.09,44.32 | LED61.C 24.88,45.82 24.88,44.32 | 24.88,44.32 v27.67,44.32 | v29.2,44.32 31.48,44.32 | LED45.C 18.53,45.82 18.53,44.32 | LED13.C 5.07,45.85 | 24.88,44.32 22.98,44.32 R32.2 | 18.53,44.32 20.68,44.32 R32.1 | 18.53,44.32 16.38,44.32 R42.2 | 11.67,44.07 R42.1 | R43.2 11.67,44.07 | R43.1 5.04,44.07 LED13.C | LED29.C 11.67,45.85 11.67,44.07 | v2.63,26.72 3.01,27.1 3.01,29.62 3.62,30.23 3.62,33.25 3.92,33.55 3.92,36.58 4.13,36.78 4.13,44.93 LED13.C
  Bottom 0.203: v54.09,44.32 v55.61,44.32 | v47.48,44.32 v49.01,44.32 | v40.88,44.32 v42.4,44.32 | v34.27,44.32 v35.8,44.32 | v27.67,44.32 v29.2,44.32 | IC2.13 15.34,33.85 14.18,35 8.16,35 3.39,30.23 3.39,27.48 v2.63,26.72
COL14  (via drill 0.36)  (3 unrouted)
  Top 0.203: LED142.C 57.9,49.4 57.9,48.39 57.39,47.88 v55.61,47.88 | 51.29,47.88 51.8,47.88 v54.09,47.88 | 51.29,47.88 51.27,47.9 LED126.C | LED110.C 44.69,49.38 44.69,47.88 | 44.69,47.88 v47.48,47.88 | v49.01,47.88 51.29,47.88 | LED94.C 38.09,49.38 38.09,47.88 | 38.09,47.88 v40.88,47.88 | v42.4,47.88 44.69,47.88 | LED78.C 31.48,49.38 31.48,47.88 | 31.48,47.88 v34.27,47.88 | v35.8,47.88 38.09,47.88 | LED62.C 24.88,49.38 24.88,47.88 | 24.88,47.88 v27.67,47.88 | v29.2,47.88 31.48,47.88 | LED46.C 18.53,49.38 18.53,47.88 | LED14.C 5.07,49.38 | 24.88,47.88 22.98,47.88 R33.2 | 18.53,47.88 20.68,47.88 R33.1 | 18.53,47.88 16.38,47.88 R40.2 | R41.2 11.67,47.62 | 11.67,47.62 R40.1 | R41.1 5.04,47.62 LED14.C | LED30.C 11.67,49.4 11.67,47.62 | v2.63,30.25 3.16,30.79 3.16,33.4 3.41,33.66 3.41,36.63 3.77,36.98 3.77,48.13 LED14.C
  Bottom 0.203: v54.09,47.88 v55.61,47.88 | v47.48,47.88 v49.01,47.88 | v40.88,47.88 v42.4,47.88 | v34.27,47.88 v35.8,47.88 | v27.67,47.88 v29.2,47.88 | IC2.14 15.67,34.17 15.35,34.49 15.35,34.54 14.36,35.54 7.91,35.54 v2.63,30.25
COL15  (via drill 0.36)  (4 unrouted)
  Top 0.203: LED143.C 57.9,52.93 57.9,51.94 57.39,51.43 v55.61,51.43 | 51.29,51.43 v54.09,51.43 | 51.29,51.43 51.27,51.46 LED127.C | LED111.C 44.69,52.93 44.69,51.43 | 44.69,51.43 45.2,51.43 v47.48,51.43 | v49.01,51.43 51.29,51.43 | LED95.C 38.09,52.93 38.09,51.43 | 38.09,51.43 v40.88,51.43 | v42.4,51.43 44.69,51.43 | LED79.C 31.48,52.93 31.48,51.43 | 31.48,51.43 v34.27,51.43 | v35.8,51.43 38.09,51.43 | 31.48,51.43 29.59,51.43 R37.2 | R36.2 24.88,51.18 | 24.88,51.18 R37.1 | R34.2 18.53,51.18 | 18.53,51.18 R36.1 | R35.2 11.67,51.18 | 11.67,51.18 R34.1 | R35.1 5.04,51.18 LED15.C 5.02,52.98 3.62,52.98 3.34,52.7 3.34,37.08 3.03,36.78 3.03,34.24 2.63,33.83 v2.63,33.78 | LED63.C 24.88,52.96 24.88,51.18 | LED47.C 18.53,52.96 18.53,51.18 | LED31.C 11.67,52.96 11.67,51.18
  Bottom 0.203: v54.09,51.43 v55.61,51.43 | v47.48,51.43 v49.01,51.43 | v40.88,51.43 v42.4,51.43 | v34.27,51.43 v35.8,51.43 | IC2.15 16.03,34.53 14.54,36.02 4.86,36.02 v2.63,33.78
COL16  (via drill 0.36)
  Top 0.203: LED144.C 57.9,56.54 57.9,57.53 57.39,58.04 51.29,58.04 | 11.67,58.04 5.07,58.04 5.04,58.02 LED16.C 4.3,56.52 2.93,56.01 2.93,37.31 2.86,37.24 v2.65,37.24 | 11.67,58.04 18.53,58.04 | 18.53,58.04 24.88,58.04 | 24.88,58.04 31.48,58.04 | 31.48,58.04 38.09,58.04 | 38.09,58.04 44.69,58.04 | 44.69,58.04 51.29,58.04 | LED32.C 11.67,56.54 11.67,58.04 | LED48.C 18.53,56.54 18.53,58.04 | LED64.C 24.88,56.54 24.88,58.04 | LED80.C 31.48,56.54 31.48,58.04 | LED96.C 38.09,56.54 38.09,58.04 | LED128.C 51.29,56.54 51.29,58.04 | LED112.C 44.69,56.54 44.69,58.04
  Bottom 0.203: IC2.16 16.4,34.95 14.84,36.5 2.4,36.5 2.4,36.98 v2.65,37.24
GND  (via drill 0.36)  (7 unrouted)
  Bottom 0.203: 18.54,29.93 IC2.29 19.09,29.37 19.09,29.36 19.39,29.06
  other vias: 26.5,39.24 19.97,45.11 20.15,41.63
  pour Top (isolate 0.076): -0.27,-0.24 59.96,-0.17 59.96,59.83 -0.27,59.75
  pour Bottom (isolate 0.254): -0.27,-0.75 60.19,-0.5 60.19,59.76 -0.52,59.5
LINE1  (via drill 0.36)
  Top 0.203: LED1.A LED2.A LED3.A v2.04,12.57 LED4.A LED5.A LED6.A LED7.A LED8.A LED9.A LED10.A LED11.A LED12.A LED13.A LED14.A LED15.A LED16.A
  Bottom 0.203: Q1/1.6 5.86,12.57 v2.04,12.57
LINE2  (via drill 0.36)
  Top 0.203: LED17.A LED18.A LED19.A 8.62,10.29 v8.62,12.57 8.64,12.57 LED20.A LED21.A LED22.A LED23.A LED24.A LED25.A LED26.A LED27.A LED28.A LED29.A LED30.A LED31.A LED32.A
  Bottom 0.203: Q1/1.4 8.62,12.54 v8.62,12.57
LINE3  (via drill 0.36)
  Top 0.203: LED33.A LED34.A LED35.A 15.5,12.57 v15.48,12.57 15.48,13.84 LED36.A LED37.A LED38.A LED39.A LED40.A LED41.A LED42.A LED43.A LED44.A LED45.A LED46.A LED47.A LED48.A
  Bottom 0.203: Q3/1.6 19.1,12.69 18.5,13.28 15.53,13.28 15.48,13.23 v15.48,12.57
LINE4  (via drill 0.36)
  Top 0.203: LED64.A LED63.A LED62.A LED61.A LED60.A LED59.A LED58.A LED57.A LED56.A LED55.A LED54.A LED53.A LED52.A 21.85,12.57 v21.83,12.57 21.83,10.29 LED51.A LED50.A LED49.A
  Bottom 0.203: Q3/1.4 21.83,12.54 v21.83,12.57
LINE5  (via drill 0.36)
  Top 0.203: LED65.A LED66.A LED67.A 28.43,10.29 v28.43,12.57 28.46,12.57 LED68.A LED69.A LED70.A LED71.A LED72.A LED73.A LED74.A LED75.A LED76.A LED77.A LED78.A LED79.A LED80.A
  Bottom 0.203: v28.43,12.57 28.43,13.31 28.46,13.34 31.84,13.34 32.04,13.13 32.04,12.56 Q5/1.6
LINE6  (via drill 0.36)
  Top 0.203: LED96.A LED95.A LED94.A LED93.A LED92.A LED91.A LED90.A LED89.A LED88.A LED87.A LED86.A LED85.A LED84.A 35.06,12.57 v35.04,12.55 v35.04,12.54 35.06,12.54 LED83.A LED82.A LED81.A
  Bottom 0.203: v35.04,12.54 Q5/1.4
LINE7  (via drill 0.36)
  Top 0.203: LED97.A LED98.A LED99.A 41.64,10.29 v41.64,12.57 41.66,12.57 LED100.A LED101.A LED102.A LED103.A LED104.A LED105.A LED106.A LED107.A LED108.A LED109.A LED110.A LED111.A LED112.A
  Bottom 0.203: Q7/1.6 41.64,12.54 v41.64,12.57
LINE8  (via drill 0.36)
  Top 0.203: LED128.A LED127.A LED126.A LED125.A LED124.A LED123.A LED122.A LED121.A LED120.A LED119.A LED118.A LED117.A LED116.A 48.27,12.57 v48.24,12.57 48.24,10.29 LED115.A LED114.A LED113.A
  Bottom 0.203: Q7/1.4 48.24,12.54 v48.24,12.57
LINE9  (via drill 0.36)
  Top 0.203: LED129.A LED130.A LED131.A 54.85,10.29 v54.85,12.57 54.85,13.84 LED132.A LED133.A LED134.A LED135.A LED136.A LED137.A LED138.A LED139.A LED140.A LED141.A LED142.A LED143.A LED144.A
  Bottom 0.203: v54.85,12.57 55.42,12.57 Q9/1.6
MISO
  Bottom 0.203: U2.23 40.75,19.02 40.73,19 40.73,18.34 36.87,14.48 36.87,11.43 35.65,10.21 32.55,10.21 31.23,8.89 31.23,7.01 JP2.5
MOSI
  Bottom 0.203: U2.22 42.02,18.54 37.7,14.22 37.7,11.41 33.77,7.47 33.77,4.21 JP2.4
N$4
  Bottom 0.203: Q1/1.1 5.32,15.72 R1.2
N$6
  Bottom 0.203: Q1/1.3 8.37,15.72 R2.2
N$7
  Bottom 0.203: Q3/1.1 19.1,15.97 R3.2
N$10
  Bottom 0.203: Q3/1.3 R4.2
N$11
  Bottom 0.203: Q5/1.1 32.05,16.3 R5.2
N$12
  Bottom 0.203: Q5/1.3 33.95,16.28 R6.2
N$13
  Bottom 0.203: IC2.27 19.23,30.59 20.99,28.83 21.5,28.83 R44.2
N$14
  Bottom 0.203: Q7/1.1 45.52,16.54 R7.2
N$15
  Bottom 1.016: IC1.1 14.18,44.8 13.96,44.58 13.96,43.64 L1.2 13.85,43.53 D1.A
N$16
  Bottom 0.203: Q7/1.3 R8.2
N$17
  Bottom 0.61: C2.2 R38.1 | C2.2 R39.2 | C2.2 14.58,47.81 IC1.3
N$18
  Bottom 0.203: Q9/1.1 55.42,16.66 R9.2
ROW1  (via drill 0.36)  (1 unrouted)
  Top 0.203: v16.32,18.57 16.6,18.85 v19.92,18.85 | v12.81,19.51 13.52,18.67 v14.16,18.67
  Bottom 0.203: R1.1 6.5,19.51 v12.81,19.51 | U2.1 39.48,28.8 36.13,25.45 28.13,25.45 21.52,18.85 v19.92,18.85 | v14.16,18.67 14.23,18.59 | 14.16,18.59 14.18,18.57 v16.32,18.57
ROW2  (via drill 0.36)
  Top 0.203: v16.6,22.1 16.8,22.3 v20.25,22.3 | v23.56,22.28 23.58,22.25 v26.53,22.25 | v14.16,17.4 13.85,17.4 v12.66,16.2
  Bottom 0.203: U2.2 40.75,29.19 36.41,24.84 32.45,24.84 29.86,22.25 v26.53,22.25 | R2.1 8.61,18.01 11.52,18.01 12.66,16.87 v12.66,16.2 | v14.16,17.4 14.26,17.5 16.67,17.5 16.9,17.73 16.9,20.7 16.6,21.01 v16.6,22.1 | v20.25,22.3 20.28,22.28 v23.56,22.28
ROW3
  Bottom 0.203: U2.3 41.97,30.61 41.97,28.32 41.21,27.56 40.02,27.56 36.69,24.23 34.2,24.23 28.22,18.25 R3.1
ROW4
  Bottom 0.203: U2.4 43.34,30.61 43.34,26.11 42.45,25.22 39.51,25.22 33.31,19.02 30.44,19.02 27.9,16.48 R4.1
ROW5
  Bottom 0.203: U2.5 44.59,30.63 44.59,26.54 42.68,24.64 39.76,24.64 33.51,18.39 31.05,18.39 30.15,17.49 R5.1
ROW6
  Bottom 0.203: U2.6 45.86,30.63 45.86,26.54 43.37,24.05 39.94,24.05 35.89,20 R6.1
ROW7
  Bottom 0.203: U2.7 47.08,30.63 47.08,27.84 46.49,27.25 46.49,25.81 48.19,24.1 54.01,24.1 54.67,23.44 54.67,19.23 53.91,18.47 52.79,18.47 52.23,17.88 50.66,17.88 50.63,17.93 44.38,17.93 43.84,17.39 R7.1
ROW8
  Bottom 0.203: U2.8 48.22,30.51 48.22,27.69 48.55,27.36 49.79,27.36 50.33,26.82 50.33,25.07 50.63,24.77 54.27,24.77 55.28,23.75 55.28,18.75 54.57,18.03 53.27,18.03 52.66,17.42 49.98,17.42 R8.1
ROW9
  Bottom 0.203: U2.9 49.67,30.63 49.67,28.58 51.17,27.08 51.17,25.73 51.45,25.45 54.8,25.45 56.07,24.18 56.07,18.69 54.95,17.58 54.04,17.58 53.67,17.21 R9.1
SCLK  (via drill 0.36)
  Top 0.203: v13.4,14.76 13.42,14.73 v13.42,12.6
  Bottom 0.203: IC2.31 18.32,28.71 18.32,28.42 13.4,23.49 v13.4,14.76 | v13.42,12.6 10.65,9.83 8.19,9.83 6.84,8.48 JP3.6
SIN  (via drill 0.36)
  Top 0.203: v10.42,12.7 v10.42,14.76 | v10.42,20.37 10.3,20.24 v10.3,17.42
  Bottom 0.203: IC2.32 15.99,27.4 15.99,26.8 12.28,23.09 12.28,22.23 v10.42,20.37 | v10.42,12.7 10.09,12.37 10.09,11.15 9.69,10.74 4.94,10.74 4.3,10.11 JP3.7 | v10.3,17.42 10.42,17.3 v10.42,14.76
SS
  Bottom 0.203: U2.21 43.29,18.77 38.52,14 38.52,10.34 36.31,8.13 JP2.3
VCC  (via drill 0.36)
  Top 0.203: v22.95,27.97 23,28.37 24.12,29.49 26.15,29.49 v26.2,29.44
  Top 0.356: v0.75,13.84 v0.75,39.24
  Bottom 0.203: 7.35,13.84 6.84,13.84 | 25.31,42.39 25.26,42.44 25.16,42.44 25.26,42.34 25.26,40.89 C1.A | 39.46,20.47 U2.24 | 19.8,39.5 20.3,38.99 20.3,33.33 22.23,31.39 23.63,31.39 25.59,29.44 v26.2,29.44 | v22.95,27.97 22.84,27.81 22.54,27.51 21.65,27.48 18.87,30.26 IC2.28 | 56.35,12.57 Q9/1.5 | 57.69,13.49 57.67,13.51 | 58.16,42.18 58.19,42.18
  Bottom 0.305: 20.05,39.5 19.8,39.5 11.67,39.5 11.67,39.24 | 58.16,42.18 58.73,41.6
  Bottom 0.356: Q1/1.2 6.84,13.84 Q1/1.5 | 20.05,13.84 33.01,13.84 | 20.05,13.84 7.35,13.84 4.81,13.84 v0.75,13.84 | 46.47,13.84 Q7/1.5 | 46.47,13.84 Q7/1.2 | 33.01,13.84 Q5/1.5 | 33.01,13.84 Q5/1.2 | 20.05,13.84 Q3/1.5 | 20.05,13.84 Q3/1.2 | 11.67,39.24 7.61,39.24 v0.75,39.24 | 58.16,42.18 58,42.34 25.26,42.34 | 39.46,20.47 39.46,17.86 35.44,13.84 33.01,13.84 | 56.35,13.51 56.35,12.57 | 46.47,13.84 46.8,13.51 56.35,13.51 | 57.67,13.51 56.35,13.51 | 57.69,13.49 58.41,13.49 59.14,14.22 59.14,41.22 58.19,42.18
  Bottom 0.61: C2.1 R38.2 | C1.A 25.26,41.02
  Bottom 1.016: C2.1 19.29,49.4 20.3,48.39 20.3,47.12 21.32,46.1 JP1.2 25.06,41.02 25.26,41.02 | D1.C 11.7,39.5 19.8,39.5 23.35,39.5 24.75,40.89 C1.A
VCC_IN
  Bottom 0.61: 17.08,45.91 IC1.5 IC1.4
  Bottom 0.762: C3.1 18.48,47.81 IC1.4
  Bottom 1.016: JP1.1 L1.1 17,43.64 17,44.58 16.78,44.8 IC1.5
XLAT  (via drill 0.36)
  Top 0.203: v17.97,15.04 17.94,14.96 17.33,14.35 17.33,12.52 v17.38,12.47
  Bottom 0.203: JP3.4 11.92,4.6 12.05,4.72 15.17,4.72 15.73,5.28 15.73,8.03 17.89,10.19 17.89,11.81 17.38,12.32 v17.38,12.47 | IC2.26 20.04,30.53 20.43,30.53 20.79,30.89 22.82,30.89 23.56,30.15 23.56,26.16 23.15,25.76 20.84,25.76 20.15,25.07 17.74,25.07 17.74,15.27 v17.97,15.04

## Text on the board
bPlace: charliex | krs | mmca | LayerOne